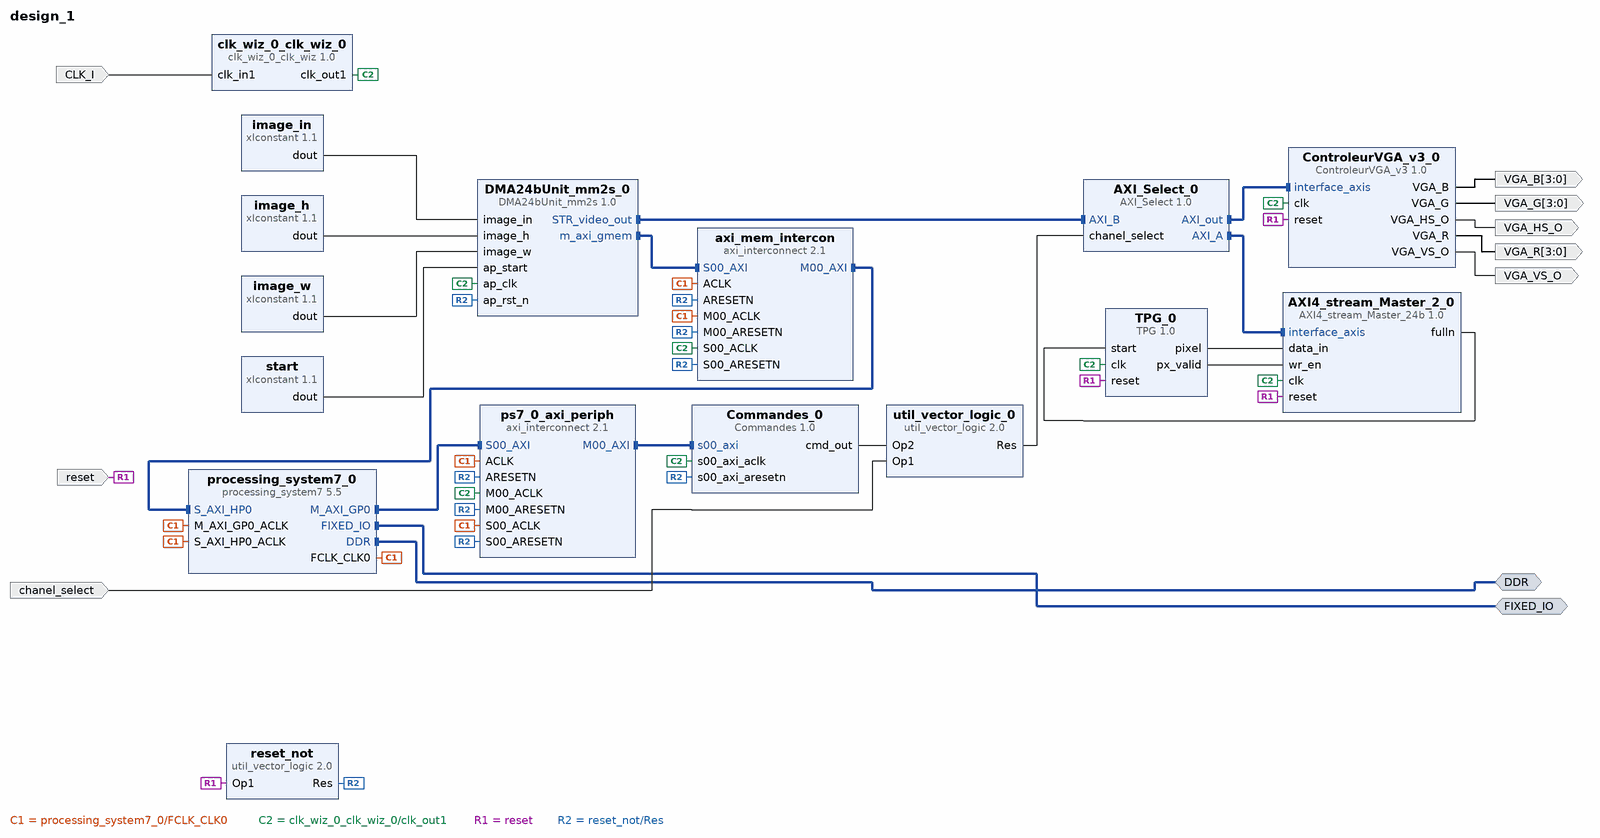
[diagram p0: block diagram of the top level]
# Vivado block design design_1, xc7z007sclg400-1, Vivado 2020.2
create_bd_design design_1

create_bd_intf_port -mode Master -vlnv xilinx.com:interface:ddrx_rtl:1.0 DDR
create_bd_intf_port -mode Master -vlnv xilinx.com:display_processing_system7:fixedio_rtl:1.0 FIXED_IO
create_bd_port -dir I CLK_I
create_bd_port -dir I -type rst reset
set_property -dict {CONFIG.POLARITY ACTIVE_HIGH} [get_bd_ports reset]
create_bd_port -dir O -from 3 -to 0 VGA_B
create_bd_port -dir O -from 3 -to 0 VGA_R
create_bd_port -dir O VGA_VS_O
create_bd_port -dir O VGA_HS_O
create_bd_port -dir O -from 3 -to 0 VGA_G
create_bd_port -dir I chanel_select

create_bd_cell -type ip -vlnv xilinx.com:ip:processing_system7:5.5 processing_system7_0
set_property -dict [list \
  CONFIG.PCW_APU_PERIPHERAL_FREQMHZ 650 \
  CONFIG.PCW_CRYSTAL_PERIPHERAL_FREQMHZ 50 \
  CONFIG.PCW_ENET0_ENET0_IO {MIO 16 .. 27} \
  CONFIG.PCW_ENET0_GRP_MDIO_ENABLE 1 \
  CONFIG.PCW_ENET0_GRP_MDIO_IO {MIO 52 .. 53} \
  CONFIG.PCW_ENET0_PERIPHERAL_ENABLE 1 \
  CONFIG.PCW_ENET0_RESET_ENABLE 1 \
  CONFIG.PCW_ENET0_RESET_IO {MIO 9} \
  CONFIG.PCW_ENET_RESET_ENABLE 1 \
  CONFIG.PCW_ENET_RESET_SELECT {Share reset pin} \
  CONFIG.PCW_FPGA0_PERIPHERAL_FREQMHZ 50 \
  CONFIG.PCW_FPGA1_PERIPHERAL_FREQMHZ 50 \
  CONFIG.PCW_GPIO_MIO_GPIO_ENABLE 1 \
  CONFIG.PCW_GPIO_MIO_GPIO_IO MIO \
  CONFIG.PCW_I2C_RESET_ENABLE 1 \
  CONFIG.PCW_PERIPHERAL_BOARD_PRESET None \
  CONFIG.PCW_PRESET_BANK1_VOLTAGE {LVCMOS 1.8V} \
  CONFIG.PCW_QSPI_PERIPHERAL_ENABLE 0 \
  CONFIG.PCW_SD0_GRP_CD_ENABLE 1 \
  CONFIG.PCW_SD0_GRP_CD_IO {MIO 47} \
  CONFIG.PCW_SD0_GRP_WP_ENABLE 0 \
  CONFIG.PCW_SD0_PERIPHERAL_ENABLE 1 \
  CONFIG.PCW_SD0_SD0_IO {MIO 40 .. 45} \
  CONFIG.PCW_SDIO_PERIPHERAL_FREQMHZ 100 \
  CONFIG.PCW_UART0_PERIPHERAL_ENABLE 1 \
  CONFIG.PCW_UART0_UART0_IO {MIO 14 .. 15} \
  CONFIG.PCW_UART1_PERIPHERAL_ENABLE 0 \
  CONFIG.PCW_UART_PERIPHERAL_FREQMHZ 100 \
  CONFIG.PCW_UIPARAM_DDR_BUS_WIDTH {16 Bit} \
  CONFIG.PCW_UIPARAM_DDR_FREQ_MHZ 525 \
  CONFIG.PCW_UIPARAM_DDR_PARTNO {MT41K256M16 RE-125} \
  CONFIG.PCW_USB0_PERIPHERAL_ENABLE 1 \
  CONFIG.PCW_USB0_RESET_ENABLE 1 \
  CONFIG.PCW_USB0_RESET_IO {MIO 46} \
  CONFIG.PCW_USB0_USB0_IO {MIO 28 .. 39} \
  CONFIG.PCW_USB_RESET_ENABLE 1 \
  CONFIG.PCW_USB_RESET_SELECT {Share reset pin} \
  CONFIG.PCW_USE_S_AXI_HP0 1 \
] [get_bd_cells processing_system7_0]
# 501 more settings of processing_system7_0 are not shown: defaults, MIO pin electricals, DDR timing, and values the tool derives
create_bd_cell -type ip -vlnv user.org:user:AXI4_stream_Master_24b:1.0 AXI4_stream_Master_2_0
create_bd_cell -type ip -vlnv user.org:user:clk_wiz_0_clk_wiz:1.0 clk_wiz_0_clk_wiz_0
create_bd_cell -type ip -vlnv user.org:user:DMA24bUnit_mm2s:1.0 DMA24bUnit_mm2s_0
create_bd_cell -type ip -vlnv user.org:user:TPG:1.0 TPG_0
create_bd_cell -type ip -vlnv xilinx.com:ip:axi_interconnect:2.1 axi_mem_intercon
set_property -dict {CONFIG.NUM_MI 1} [get_bd_cells axi_mem_intercon]
create_bd_cell -type ip -vlnv xilinx.com:ip:util_vector_logic:2.0 reset_not
set_property -dict {CONFIG.C_OPERATION not CONFIG.C_SIZE 1} [get_bd_cells reset_not]
create_bd_cell -type ip -vlnv xilinx.com:ip:xlconstant:1.1 image_in
set_property -dict {CONFIG.CONST_VAL 0x00400000 CONFIG.CONST_WIDTH 64} [get_bd_cells image_in]
create_bd_cell -type ip -vlnv xilinx.com:ip:xlconstant:1.1 image_h
set_property -dict {CONFIG.CONST_VAL 480 CONFIG.CONST_WIDTH 12} [get_bd_cells image_h]
create_bd_cell -type ip -vlnv xilinx.com:ip:xlconstant:1.1 image_w
set_property -dict {CONFIG.CONST_VAL 640 CONFIG.CONST_WIDTH 12} [get_bd_cells image_w]
create_bd_cell -type ip -vlnv xilinx.com:ip:xlconstant:1.1 start
create_bd_cell -type ip -vlnv user.org:user:Commandes:1.0 Commandes_0
create_bd_cell -type ip -vlnv xilinx.com:ip:axi_interconnect:2.1 ps7_0_axi_periph
set_property -dict {CONFIG.NUM_MI 1} [get_bd_cells ps7_0_axi_periph]
create_bd_cell -type ip -vlnv xilinx.com:ip:util_vector_logic:2.0 util_vector_logic_0
set_property -dict {CONFIG.C_OPERATION or CONFIG.C_SIZE 1} [get_bd_cells util_vector_logic_0]
create_bd_cell -type ip -vlnv user.org:user:AXI_Select:1.0 AXI_Select_0
create_bd_cell -type ip -vlnv user.org:user:ControleurVGA_v3:1.0 ControleurVGA_v3_0

# ---- connections ----

connect_bd_intf_net [get_bd_intf_pins DMA24bUnit_mm2s_0/m_axi_gmem] [get_bd_intf_pins axi_mem_intercon/S00_AXI]
connect_bd_intf_net [get_bd_intf_pins AXI_Select_0/AXI_out] [get_bd_intf_pins ControleurVGA_v3_0/interface_axis]
connect_bd_intf_net [get_bd_intf_pins AXI_Select_0/AXI_A] [get_bd_intf_pins AXI4_stream_Master_2_0/interface_axis]
connect_bd_intf_net [get_bd_intf_pins AXI_Select_0/AXI_B] [get_bd_intf_pins DMA24bUnit_mm2s_0/STR_video_out]
connect_bd_intf_net [get_bd_intf_pins axi_mem_intercon/M00_AXI] [get_bd_intf_pins processing_system7_0/S_AXI_HP0]
connect_bd_intf_net [get_bd_intf_pins ps7_0_axi_periph/M00_AXI] [get_bd_intf_pins Commandes_0/s00_axi]
connect_bd_intf_net [get_bd_intf_ports FIXED_IO] [get_bd_intf_pins processing_system7_0/FIXED_IO]
connect_bd_intf_net [get_bd_intf_ports DDR] [get_bd_intf_pins processing_system7_0/DDR]
connect_bd_intf_net [get_bd_intf_pins processing_system7_0/M_AXI_GP0] [get_bd_intf_pins ps7_0_axi_periph/S00_AXI]
connect_bd_net [get_bd_pins processing_system7_0/FCLK_CLK0] \
  [get_bd_pins processing_system7_0/M_AXI_GP0_ACLK] [get_bd_pins processing_system7_0/S_AXI_HP0_ACLK] \
  [get_bd_pins axi_mem_intercon/ACLK] [get_bd_pins axi_mem_intercon/M00_ACLK] [get_bd_pins ps7_0_axi_periph/ACLK] \
  [get_bd_pins ps7_0_axi_periph/S00_ACLK]
connect_bd_net -net clk_in1_0_1 [get_bd_ports CLK_I] [get_bd_pins clk_wiz_0_clk_wiz_0/clk_in1]
connect_bd_net [get_bd_pins clk_wiz_0_clk_wiz_0/clk_out1] \
  [get_bd_pins TPG_0/clk] [get_bd_pins DMA24bUnit_mm2s_0/ap_clk] [get_bd_pins AXI4_stream_Master_2_0/clk] \
  [get_bd_pins axi_mem_intercon/S00_ACLK] [get_bd_pins Commandes_0/s00_axi_aclk] [get_bd_pins ps7_0_axi_periph/M00_ACLK] \
  [get_bd_pins ControleurVGA_v3_0/clk]
connect_bd_net [get_bd_pins TPG_0/pixel] [get_bd_pins AXI4_stream_Master_2_0/data_in]
connect_bd_net [get_bd_pins TPG_0/px_valid] [get_bd_pins AXI4_stream_Master_2_0/wr_en]
connect_bd_net [get_bd_pins AXI4_stream_Master_2_0/fulln] [get_bd_pins TPG_0/start]
connect_bd_net -net reset_0_1 [get_bd_ports reset] \
  [get_bd_pins AXI4_stream_Master_2_0/reset] [get_bd_pins TPG_0/reset] [get_bd_pins reset_not/Op1] \
  [get_bd_pins ControleurVGA_v3_0/reset]
connect_bd_net -net util_vector_logic_0_Res [get_bd_pins reset_not/Res] \
  [get_bd_pins DMA24bUnit_mm2s_0/ap_rst_n] [get_bd_pins axi_mem_intercon/S00_ARESETN] \
  [get_bd_pins axi_mem_intercon/M00_ARESETN] [get_bd_pins axi_mem_intercon/ARESETN] \
  [get_bd_pins ps7_0_axi_periph/S00_ARESETN] [get_bd_pins Commandes_0/s00_axi_aresetn] \
  [get_bd_pins ps7_0_axi_periph/M00_ARESETN] [get_bd_pins ps7_0_axi_periph/ARESETN]
connect_bd_net [get_bd_pins image_in/dout] [get_bd_pins DMA24bUnit_mm2s_0/image_in]
connect_bd_net [get_bd_pins image_h/dout] [get_bd_pins DMA24bUnit_mm2s_0/image_h]
connect_bd_net [get_bd_pins image_w/dout] [get_bd_pins DMA24bUnit_mm2s_0/image_w]
connect_bd_net [get_bd_pins start/dout] [get_bd_pins DMA24bUnit_mm2s_0/ap_start]
connect_bd_net [get_bd_pins ControleurVGA_v3_0/VGA_B] [get_bd_ports VGA_B]
connect_bd_net [get_bd_pins ControleurVGA_v3_0/VGA_R] [get_bd_ports VGA_R]
connect_bd_net [get_bd_pins ControleurVGA_v3_0/VGA_VS_O] [get_bd_ports VGA_VS_O]
connect_bd_net [get_bd_pins ControleurVGA_v3_0/VGA_HS_O] [get_bd_ports VGA_HS_O]
connect_bd_net [get_bd_pins ControleurVGA_v3_0/VGA_G] [get_bd_ports VGA_G]
connect_bd_net [get_bd_ports chanel_select] [get_bd_pins util_vector_logic_0/Op1]
connect_bd_net [get_bd_pins Commandes_0/cmd_out] [get_bd_pins util_vector_logic_0/Op2]
connect_bd_net [get_bd_pins util_vector_logic_0/Res] [get_bd_pins AXI_Select_0/chanel_select]

# ---- address map ----
assign_bd_address -offset 0x0000000000000000 -range 512M -target_address_space [get_bd_addr_spaces DMA24bUnit_mm2s_0/m_axi_gmem] [get_bd_addr_segs processing_system7_0/S_AXI_HP0/HP0_DDR_LOWOCM]
assign_bd_address -offset 0x43C00000 -range 64K -target_address_space [get_bd_addr_spaces processing_system7_0/Data] [get_bd_addr_segs Commandes_0/s00_axi/reg0]

validate_bd_design
save_bd_design
